# Altium project L-D5019-01-05.PrjPcb
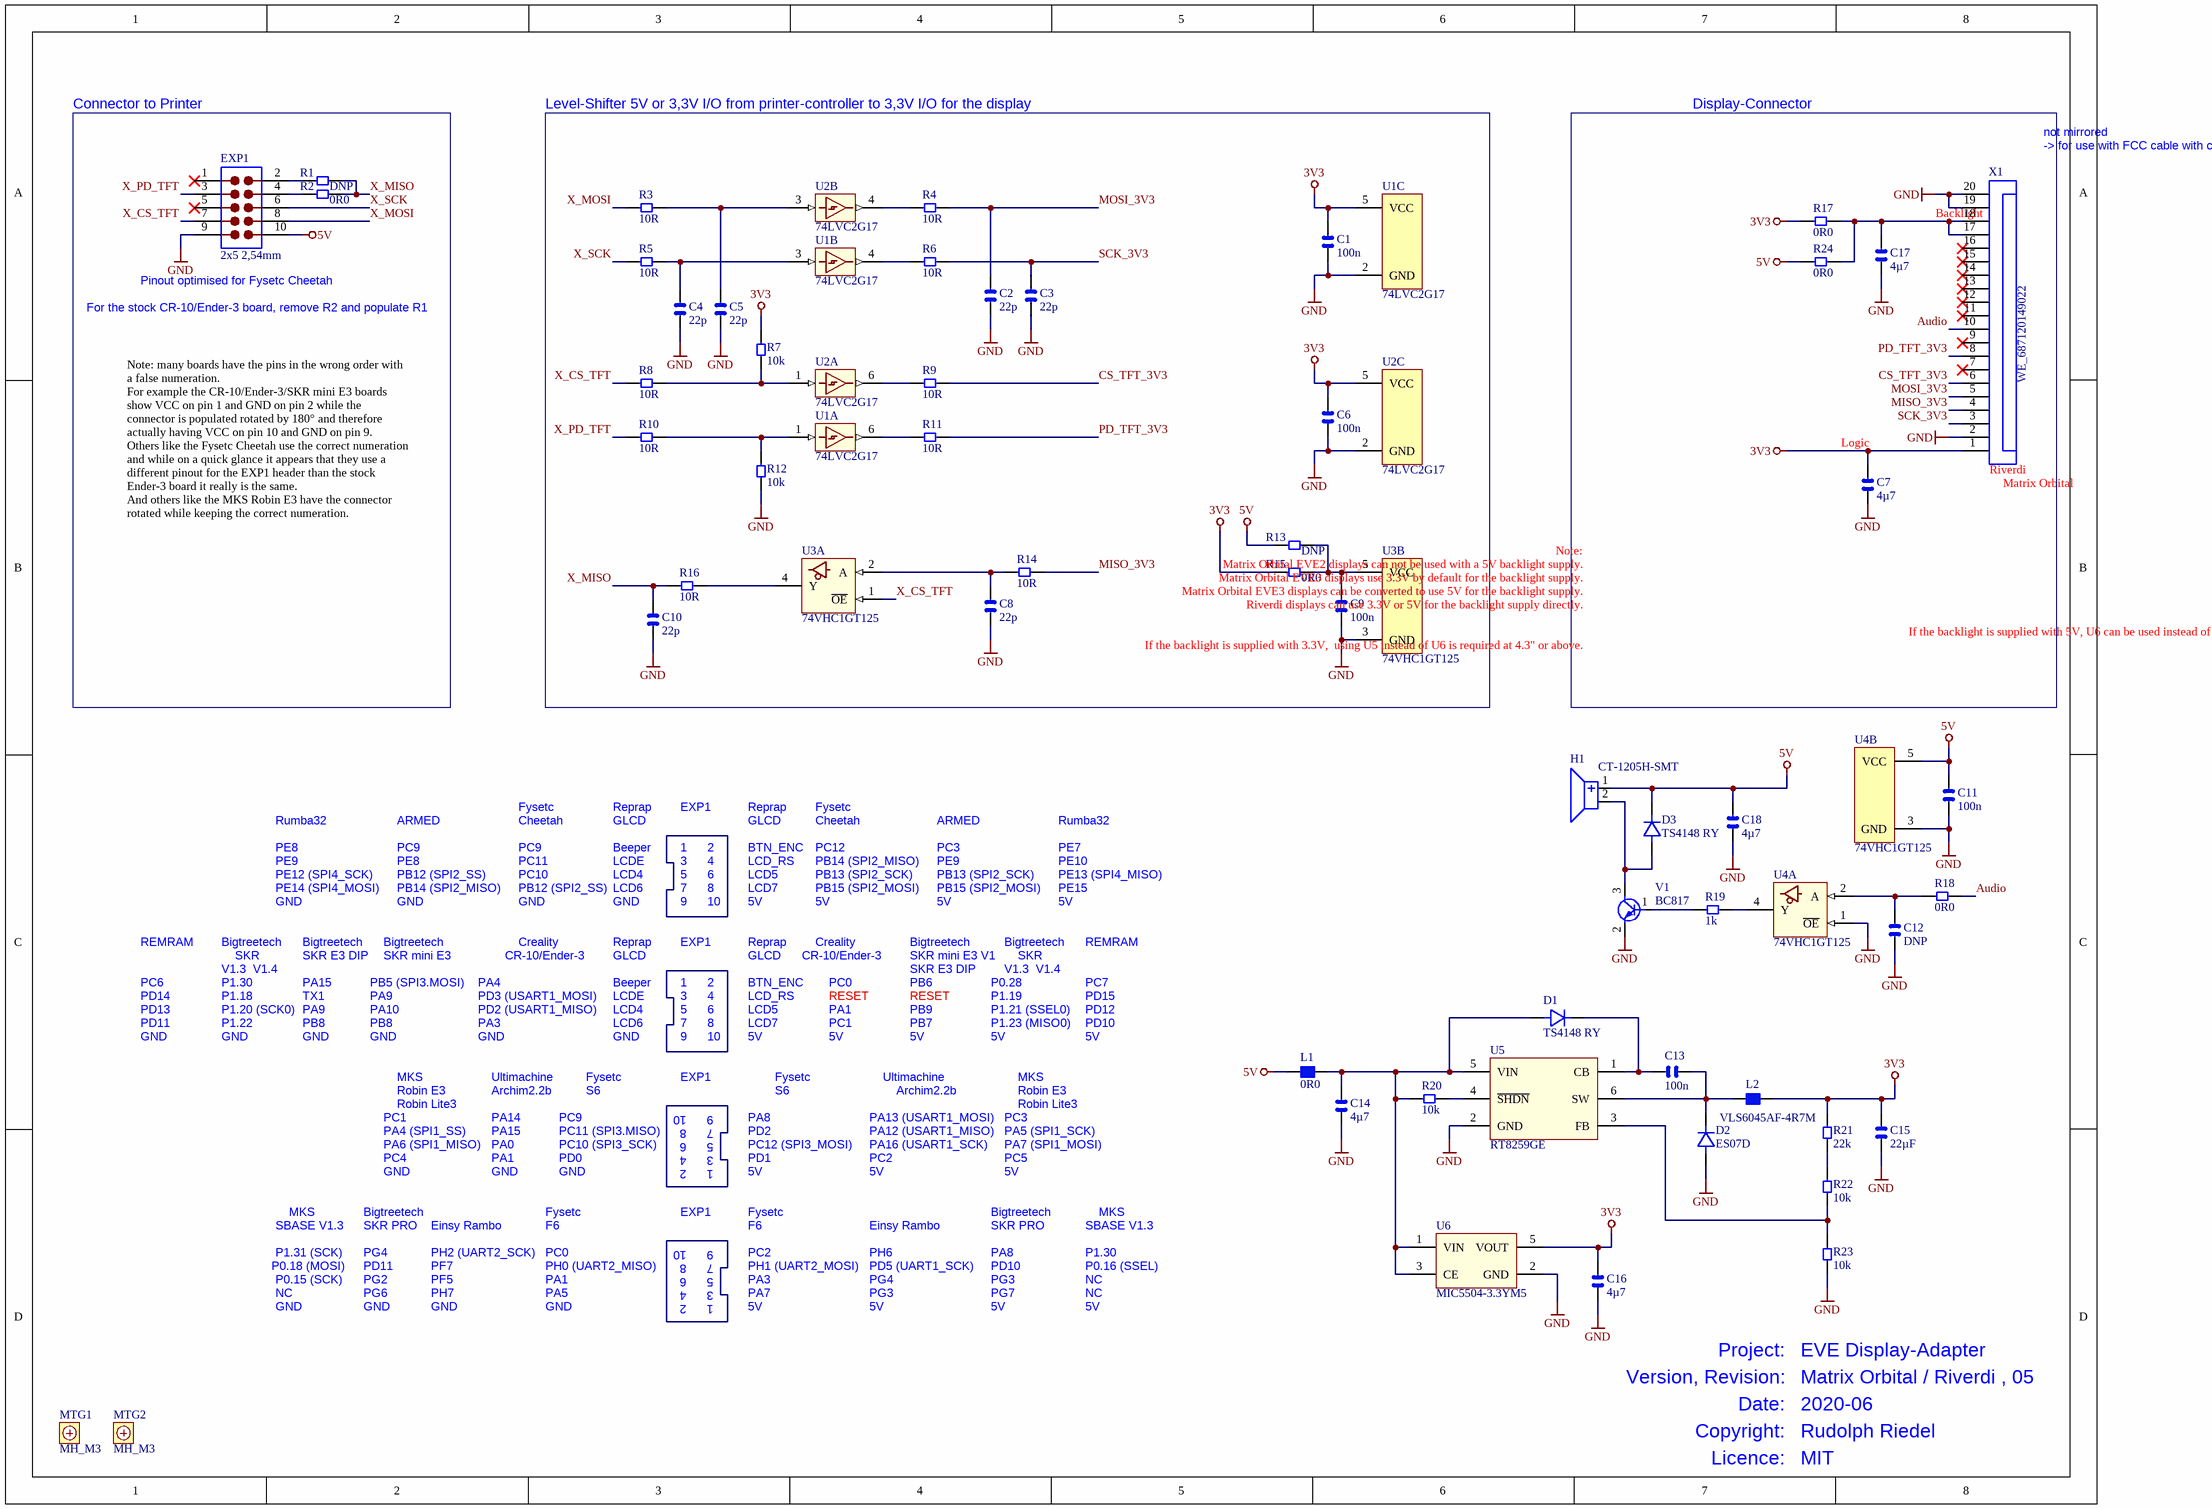
[diagram p0: L-D5019-01-05.SchDoc]
1 sheet, 59 parts. Net scope: global (net labels, ports and power ports of the same name join across sheets).
Board file: L-D5019-01-05.PcbDoc

## Sheet L-D5019-01-05.SchDoc: Sheet Description
size A3; Organization: Organization; Address1: Address1; Address2: Address2; Address3: Address3; Address4: Address4; DocumentNumber: 1; Revision: 0; SheetNumber: 2; SheetTotal: 5; PageSetup: Record=PageOptions|CenterHorizontal=True|CenterVertical=True|PrintScale=1.00|XCorrection=1.00|YCorrection=1.00|PrintKind=1|BorderSize=5000000|LeftOffset=0|BottomOffset=0|Orientation=2|PaperLength=1000|PaperWidth=1000|Scale=100|PaperSource=7|PrintQuality=-4|MediaType=1|DitherType=10|PaperKind=A3|PrintScaleMode=0

### Parts
C1  100n  [CAPC2012X14L]
C2  22p  [CAPC2012X14L]
C3  22p  [CAPC2012X14L]
C4  22p  [CAPC2012X14L]
C5  22p  [CAPC2012X14L]
C6  100n  [CAPC2012X14L]
C7  4µ7  [CAPC2012X14L]
C8  22p  [CAPC2012X14L]
C9  100n  [CAPC2012X14L]
C10  22p  [CAPC2012X14L]
C11  100n  [CAPC2012X14L]
C12  DNP  [CAPC2012X14L]
C13  100n  [CAPC2012X14L]
C14  4µ7  [CAPC2012X14L]
C15  22µF  [CAPC3216X19N]
C16  4µ7  [CAPC2012X14L]
C17  4µ7  [CAPC2012X14L]
C18  4µ7  [CAPC2012X14L]
D1  TS4148 RY  [DIOC2012X10N]
D2  ES07D  [DIOM2818X11N]
D3  TS4148 RY  [DIOC2012X10N]
EXP1  2x5 2,54mm  [PINH_2x5_2_54mm_shroud]
H1  CT-1205H-SMT  [CT-1205H-SMT]
L1  0R0  [INDC2012X10L]
L2  VLS6045AF-4R7M  [PowerInductor_6x6]
MTG1  MH_M3  [HOLE_3_2MM]  (no BOM)
MTG2  MH_M3  [HOLE_3_2MM]  (no BOM)
R1  DNP  [RESC2012X06L]
R2  0R0  [RESC2012X06L]
R3  10R  [RESC2012X06L]
R4  10R  [RESC2012X06L]
R5  10R  [RESC2012X06L]
R6  10R  [RESC2012X06L]
R7  10k  [RESC2012X06L]
R8  10R  [RESC2012X06L]
R9  10R  [RESC2012X06L]
R10  10R  [RESC2012X06L]
R11  10R  [RESC2012X06L]
R12  10k  [RESC2012X06L]
R13  DNP  [RESC2012X06L]
R14  10R  [RESC2012X06L]
R15  0R0  [RESC2012X06L]
R16  10R  [RESC2012X06L]
R17  0R0  [RESC2012X06L]
R18  0R0  [RESC2012X06L]
R19  1k  [RESC2012X06L]
R20  10k  [RESC2012X06L]
R21  22k  [RESC2012X06L]
R22  10k  [RESC2012X06L]
R23  10k  [RESC2012X06L]
R24  0R0  [RESC2012X06L]
U1  74LVC2G17  [SOT95P280X110-6N]  (parts A,B,C of 3)
U2  74LVC2G17  [SOT95P280X110-6N]  (parts A,B,C of 3)
U3  74VHC1GT125  [SOT95P280X110-5N]  (parts A,B of 2)
U4  74VHC1GT125  [SOT95P280X110-5N]  (parts A,B of 2)
U5  RT8259GE  [SOT95P280X110-6N]
U6  MIC5504-3.3YM5  [SOT95P280X110-5N]
V1  BC817  [SOT95P280X110-3N]
X1  WE_687120149022  [WE_687120149022]

### Blocks framed on the sheet
Connector to Printer: EXP1 R1 R2
Display-Connector: C7 C17 R17 R24 X1

### Nets
3V3: C1.2 C6.2 C7.2 C15.2 C16.2 L2.2 R7.2 R15.1 R17.1 R21.2 U1.5(VCC) U2.5(VCC) U6.5(VOUT) X1.1
5V: C11.2 C18.2 D3.1 EXP1.10 H1.1 L1.1 R13.1 R24.1 U4.5(VCC)
GND: C1.1 C2.1 C3.1 C4.1 C5.1 C6.1 C7.1 C8.1 C9.1 C10.1 C11.1 C12.1 C14.1 C15.1 C16.1 C17.1 C18.1 D2.2 EXP1.9 R12.1 R23.1 U1.2(GND) U2.2(GND) U3.3(GND) U4.1(~{OE}) U4.3(GND) U5.2(GND) U6.2(GND) V1.2 X1.2 X1.19 X1.20
Audio: R18.2 X1.10
CS_TFT_3V3: R9.2 X1.6
MISO_3V3: R14.2 X1.4
MOSI_3V3: C2.2 R4.2 X1.5
PD_TFT_3V3: R11.2 X1.8
SCK_3V3: C3.2 R6.2 X1.3
X_CS_TFT: EXP1.7 R8.1 U3.1(~{OE})
X_MISO: C10.2 R1.2 R2.2 R16.1
X_MOSI: EXP1.8 R3.1
X_PD_TFT: EXP1.3 R10.1
X_SCK: EXP1.6 R5.1
NetC4_2: C4.2 R5.2 U1.3(2A)
NetC5_2: C5.2 R3.2 U2.3(2A)
NetC8_2: C8.2 R14.1 U3.2(A)
NetC9_2: C9.2 R13.2 R15.2 U3.5(VCC)
NetC12_2: C12.2 R18.1 U4.2(A)
NetC13_1: C13.1 D1.1 U5.1(CB)
NetC13_2: C13.2 D2.1 L2.1 U5.6(SW)
NetC14_2: C14.2 D1.2 L1.2 R20.1 U5.5(VIN) U6.1(VIN) U6.3(CE)
NetC17_2: C17.2 R17.2 R24.2 X1.17 X1.18
NetD3_2: D3.2 H1.2 V1.3
NetEXP1_2: EXP1.2 R1.1
NetEXP1_4: EXP1.4 R2.1
NetR4_1: R4.1 U2.4(2Y)
NetR6_1: R6.1 U1.4(2Y)
NetR7_1: R7.1 R8.2 U2.1(1A)
NetR9_1: R9.1 U2.6(1Y)
NetR10_2: R10.2 R12.2 U1.1(1A)
NetR11_1: R11.1 U1.6(1Y)
NetR16_2: R16.2 U3.4(Y)
NetR19_1: R19.1 U4.4(Y)
NetR19_2: R19.2 V1.1
NetR20_2: R20.2 U5.4(~{SHDN})
NetR21_1: R21.1 R22.2
NetR22_1: R22.1 R23.2 U5.3(FB)

Not connected (* = marked no-connect by the designer): EXP1 1* 5*; X1 7* 9* 11* 12* 13* 14* 15* 16*

### Notes on the sheet
- Level-Shifter 5V or 3,3V I/O from printer-controller to 3,3V I/O for the display
- (near X1) -> for use with FCC cable with connections on opposite sides
- not mirrored
- (near C17) Backlight
- For the stock CR-10/Ender-3 board, remove R2 and populate R1
- (near EXP1) Pinout optimised for Fysetc Cheetah
- (near C7) Logic
- (near X1) Riverdi
- (near X1) Matrix Orbital
- Note: many boards have the pins in the wrong order with a false numeration.
  For example the CR-10/Ender-3/SKR mini E3 boards show VCC on pin 1 and GND on pin 2 while the connector is populated rotated by 180° and therefore actually having VCC on pin 10 and GND on pin 9.
  Others like the Fysetc Cheetah use the correct numeration and while on a quick glance it appears that they use a different pinout for the EXP1 header than the stock Ender-3 board it really is the same.
  And others like the MKS Robin E3 have the connector rotated while keeping the correct numeration.
- Matrix Orbital EVE2 displays can not be used with a 5V backlight supply.
- Note:
- Matrix Orbital EVE3 displays use 3.3V by default for the backlight supply.
- Riverdi displays can use 3.3V or 5V for the backlight supply directly.
- If the backlight is supplied with 3.3V,  using U5 instead of U6 is required at 4.3" or above.
- Matrix Orbital EVE3 displays can be converted to use 5V for the backlight supply.
- If the backlight is supplied with 5V, U6 can be used instead of U5.
- Rumba32
- PE8
- ARMED
- PC9
- Cheetah
- Fysetc
- Beeper
- Reprap
- GLCD
- 1
- EXP1
- 2
- BTN_ENC
- PC12
- PC3
- PE7
- GND
- PE9
- PE12 (SPI4_SCK)
- PE14 (SPI4_MOSI)
- PB12 (SPI2_SS)
- PB14 (SPI2_MISO)
- PC10
- PC11
- LCDE
- LCD4
- LCD6
- 3
- 5
- 7
- 9
- 4
- 6
- 8
- 10
- LCD_RS
- 5V
- LCD5
- LCD7
- PB13 (SPI2_SCK)
- PB15 (SPI2_MOSI)
- PE10
- PE13 (SPI4_MISO)
- PE15
- REMRAM
- PC6
- Bigtreetech
- P1.30
- V1.3  V1.4
- SKR
- SKR E3 DIP
- PA15
- PB5 (SPI3.MOSI)
- SKR mini E3
- PA4
- CR-10/Ender-3
- Creality
- PC0
- PB6
- SKR mini E3 V1
- P0.28
- PC7
- PD14
- PD13
- PD11
- P1.18
- P1.20 (SCK0)
- P1.22
- TX1
- PA9
- PB8
- PA10
- PD3 (USART1_MOSI)
- PD2 (USART1_MISO)
- PA3
- RESET
- PA1
- PC1
- PB7
- PB9
- P1.19
- P1.21 (SSEL0)
- P1.23 (MISO0)
- PD15
- PD12
- PD10
- MKS
- Robin E3
- Robin Lite3
- Archim2.2b
- Ultimachine
- PA14
- S6
- PA8
- PA13 (USART1_MOSI)
- PC4
- PA6 (SPI1_MISO)
- PA4 (SPI1_SS)
- PA0
- PC11 (SPI3.MISO)
- PC10 (SPI3_SCK)
- PD0
- PD1
- PC12 (SPI3_MOSI)
- PD2
- PA16 (USART1_SCK)
- PA12 (USART1_MISO)
- PC2
- PC5
- PA7 (SPI1_MOSI)
- PA5 (SPI1_SCK)
- SBASE V1.3
- P1.31 (SCK)
- SKR PRO
- PG4
- Einsy Rambo
- PH2 (UART2_SCK)
- F6
- PH6
- P0.18 (MOSI)
- NC
- P0.15 (SCK)
- PG6
- PG2
- PH7
- PF5
- PF7
- PA5
- PH0 (UART2_MISO)
- PH1 (UART2_MOSI)
- PA7
- PG3
- PD5 (UART1_SCK)
- PG7
- P0.16 (SSEL)
- Project:
- Version, Revision:
- EVE Display-Adapter
- Matrix Orbital / Riverdi , 05
- Date:
- Copyright:
- 2020-06
- Rudolph Riedel
- Licence:
- MIT
- A3_base_en_02.005
- Title:
- PCBA:
- Project Leader:
- Schematic State:
- IAV-PCBA:
- Cust.PCBA:
- IAV-
- -
- Editor:
- Variant:
- Variant State:
- Edited:
- Revision:
- Printed:
- Document:
- ©
- File:
- Page:
- of

### Library data of the parts
C1-C6 C8-C13 = CAPC_0805: 0805 Chip Capacitor; Editor: rriedel; Kategorie: generic; Unterart: unpolarized; Part Number: CAPC_0805; Status: tested; Bauteilart: Capacitor; PackageDescription: 0805
  C1 C6 C9 C11 C13: Value: 100n
  C2-C5 C8 C10: Value: 22p
  C12: Value: DNP
C7 C14 C16-C18 = CAPC_0805: 0805 Chip Capacitor; Ersteller: rriedel; Freigabe: unchecked; Bauteilart: Kondensator; Kategorie: generisch; Unterart: ungepolt; Polar: u; ID: 894; Part Number: CAPC_0805; Value: 4µ7; PackageDescription: 0805; Mounting: SMT; timestamp: 17.08.2016 13:43:45
C15 = CAPC_1206: 1206 Chip Capacitor; Editor: rriedel; Kategorie: generic; Unterart: unpolarized; Part Number: CAPC_1206; Value: 22µF; Status: tested; Bauteilart: Capacitor; PackageDescription: 1206
D1 D3 = TSC_TS4148 RY: Small Signal Diode IF 0.3A, VR 75V, 0805; Manufacturer: TSC; Editor: rriedel; Kategorie: Part; Part Number: TSC_TS4148 RY; Value: TS4148 RY; Status: tested; Date: 09.10.2013; Bauteilart: Diode; Unterart: Small Signal; PackageDescription: 0805; Part_Number_1: TS4148 RY
D2 = ES07D: Ultrafast Rectifier Surface Mount,  IF 0.5A, VR 100V, DO-219AB, AEC-Q101; Manufacturer: Vishay; Editor: rriedel; Kategorie: Part; Bauteilart: Diode; Part Number: ES07D; Value: ES07D; Status: tested; Date: 09.10.2013; Unterart: Rectifier; PackageDescription: DO-219AB; Part_Number_1: ES07D
EXP1 = PINH_2x5_2_54: Pin-Header 2,54 mm 2x5pins, shrouded; Editor: rriedel; Kategorie: generic; Bauteilart: Connector; Part Number: PINH_2x5_2_54; Value: 2x5 2,54mm; Status: tested; Date: 31.03.2019; Unterart: Pin-Header
H1 = CT-1205H-SMT: Speaker, Magnetic, 47R, 60mA, 88dBA, SMT, 12.8 x 12.8 mm,  height 10 mm; Manufacturer: CUI; Part_Number_1: CT-1205H-SMT-TR; Editor: rriedel; Kategorie: Part; Bauteilart: Electromechanical; Part Number: CT-1205H-SMT; Value: CT-1205H-SMT; Status: new; Date: 10.06.2020; Unterart: Speaker; PackageDescription: SMT, 13x13; Distributor_1: Digi-Key; Distributor_1_Part_Number: 102-1266-1-ND
L1 = INDC_0805: 0805 Chip Inductor; Editor: rriedel; Kategorie: generic; Part Number: INDC_0805; Value: 0R0; Status: tested; Date: 31.03.2019; Bauteilart: Inductor; Unterart: generic; PackageDescription: 0805
L2 = VLS6045AF-4R7M: 4,7µH, shielded, 4,7A, 26mR; Manufacturer: TDK; Editor: rriedel; Kategorie: Part; Bauteilart: Inductor; Unterart: Power; Part Number: VLS6045AF-4R7M; Value: VLS6045AF-4R7M; Status: tested; Date: 31.03.2019; PackageDescription: 6x6 mm; Part_Number_1: VLS6045AF-4R7M; Distributor_1: Digi-Key; Distributor_1_Part_Number: 445-180835-1-ND
MTG1 MTG2 = MH_M3: Mounting-Hole for M3 screws; Editor: rriedel; Kategorie: No_Bom; Bauteilart: Mechanic; Unterart: Holes; Part Number: MH_M3; Value: MH_M3; Status: tested; Date: 13.05.2018
R1-R24 = RESC_0805: 0805 Chip Resistor; Editor: rriedel; Kategorie: generic; Part Number: RESC_0805; Status: tested; Bauteilart: Resistor; Unterart: generic; PackageDescription: 0805
  R1 R13: Value: DNP
  R2 R15 R17 R18 R24: Value: 0R0
  R3-R6 R8-R11 R14 R16: Value: 10R
  R7 R12 R20 R22 R23: Value: 10k
  R19: Value: 1k
  R21: Value: 22k
U1 U2 = 74LVC2G17: Dual Schmitt-Trigger Buffer with 5.5V tolerant inputs; Manufacturer: TI; Part_Number_1: 74LVC2G17DBVR; Editor: rriedel; Kategorie: Part; Bauteilart: IC; Unterart: Logic; Part Number: 74LVC2G17; Value: 74LVC2G17; Status: tested; Date: 08.05.2020; PackageDescription: SOT23-6; Distributor_1: Digi-Key; Distributor_1_Part_Number: 296-SN74LVC2G17DBVRCT-ND‎
U3 U4 = 74VHC1GT125: 1x Buffer with OE; 3-state,Level Shifter 3,3V to 5V and 5V to 3.3V; Manufacturer: ON Semiconductor; Part_Number_1: M74VHC1G125DT1G; Editor: rriedel; Kategorie: Part; Bauteilart: IC; Unterart: Logic; Part Number: 74VHC1GT125; Value: 74VHC1GT125; Status: tested; Date: 21.01.2011; PackageDescription: SOT23-5; Distributor_1: Farnell; Distributor_1_Part_Number: 1703291
U5 = RT8259GE: Step-Down DC/DC Regulator, 24V, 1.2A, 1,4MHz; Manufacturer: Richtek; Editor: rriedel; Kategorie: Part; Bauteilart: IC; Unterart: Switching-Regulators; Part Number: RT8259GE; Value: RT8259GE; Status: tested; Date: 31.03.2019; PackageDescription: SOT23-6; Part_Number_1: RT8259GE; Distributor_1: Digi-Key; Distributor_1_Part_Number: 1028-1497-1-ND
U6 = MIC5504-3.3YM5: 300 mA LDO,  Vin=2,5V…5,5V, Vout= 3,3V, -40°C..125°C; Manufacturer: Microchip; Editor: rriedel; Kategorie: Part; Bauteilart: IC; Unterart: Linear-Regulators; Part Number: MIC5504-3.3YM5; Value: MIC5504-3.3YM5; Status: tested; Date: 23.05.2019; PackageDescription: SOT23-5; Part_Number_1: MIC5504-3.3YM5; Distributor_1: Farnell; Distributor_1_Part_Number: 2510377
V1 = BC817: NPN Transistor SOT23, 1=B, 2=C, 3=E; Editor: rriedel; Kategorie: Part; Part Number: BC817; Value: BC817; Status: tested; Date: 23.05.2020; Bauteilart: Transistor; Unterart: NPN; PackageDescription: SOT23
X1 = WE_687120149022: 20pin WR-FPC 0.50 mm SMT ZIF Horizontal - Bottom Contact; Manufacturer: Wuerth; Part_Number_1: 6.8712014902e+011; Editor: rriedel; Kategorie: Part; Bauteilart: Connector; Unterart: FPC; Part Number: WE_687120149022; Value: WE_687120149022; Status: tested; Date: 25.05.2020; PackageDescription: FPC 0.5mm; Distributor_1: Digi-Key; Distributor_1_Part_Number: 732-6002-1-ND

## Assembly variants
Default: not fitted C8 C10 C12 C13 C15 D1 D2 L2 R1 R13 R17 R20 R21 R22 R23 U5
EVE2/EVE3 default: not fitted C8 C10 C12 C16 R1 R13 R24 U6